# EAGLE schematic v3 (EAGLE 9.6.2)
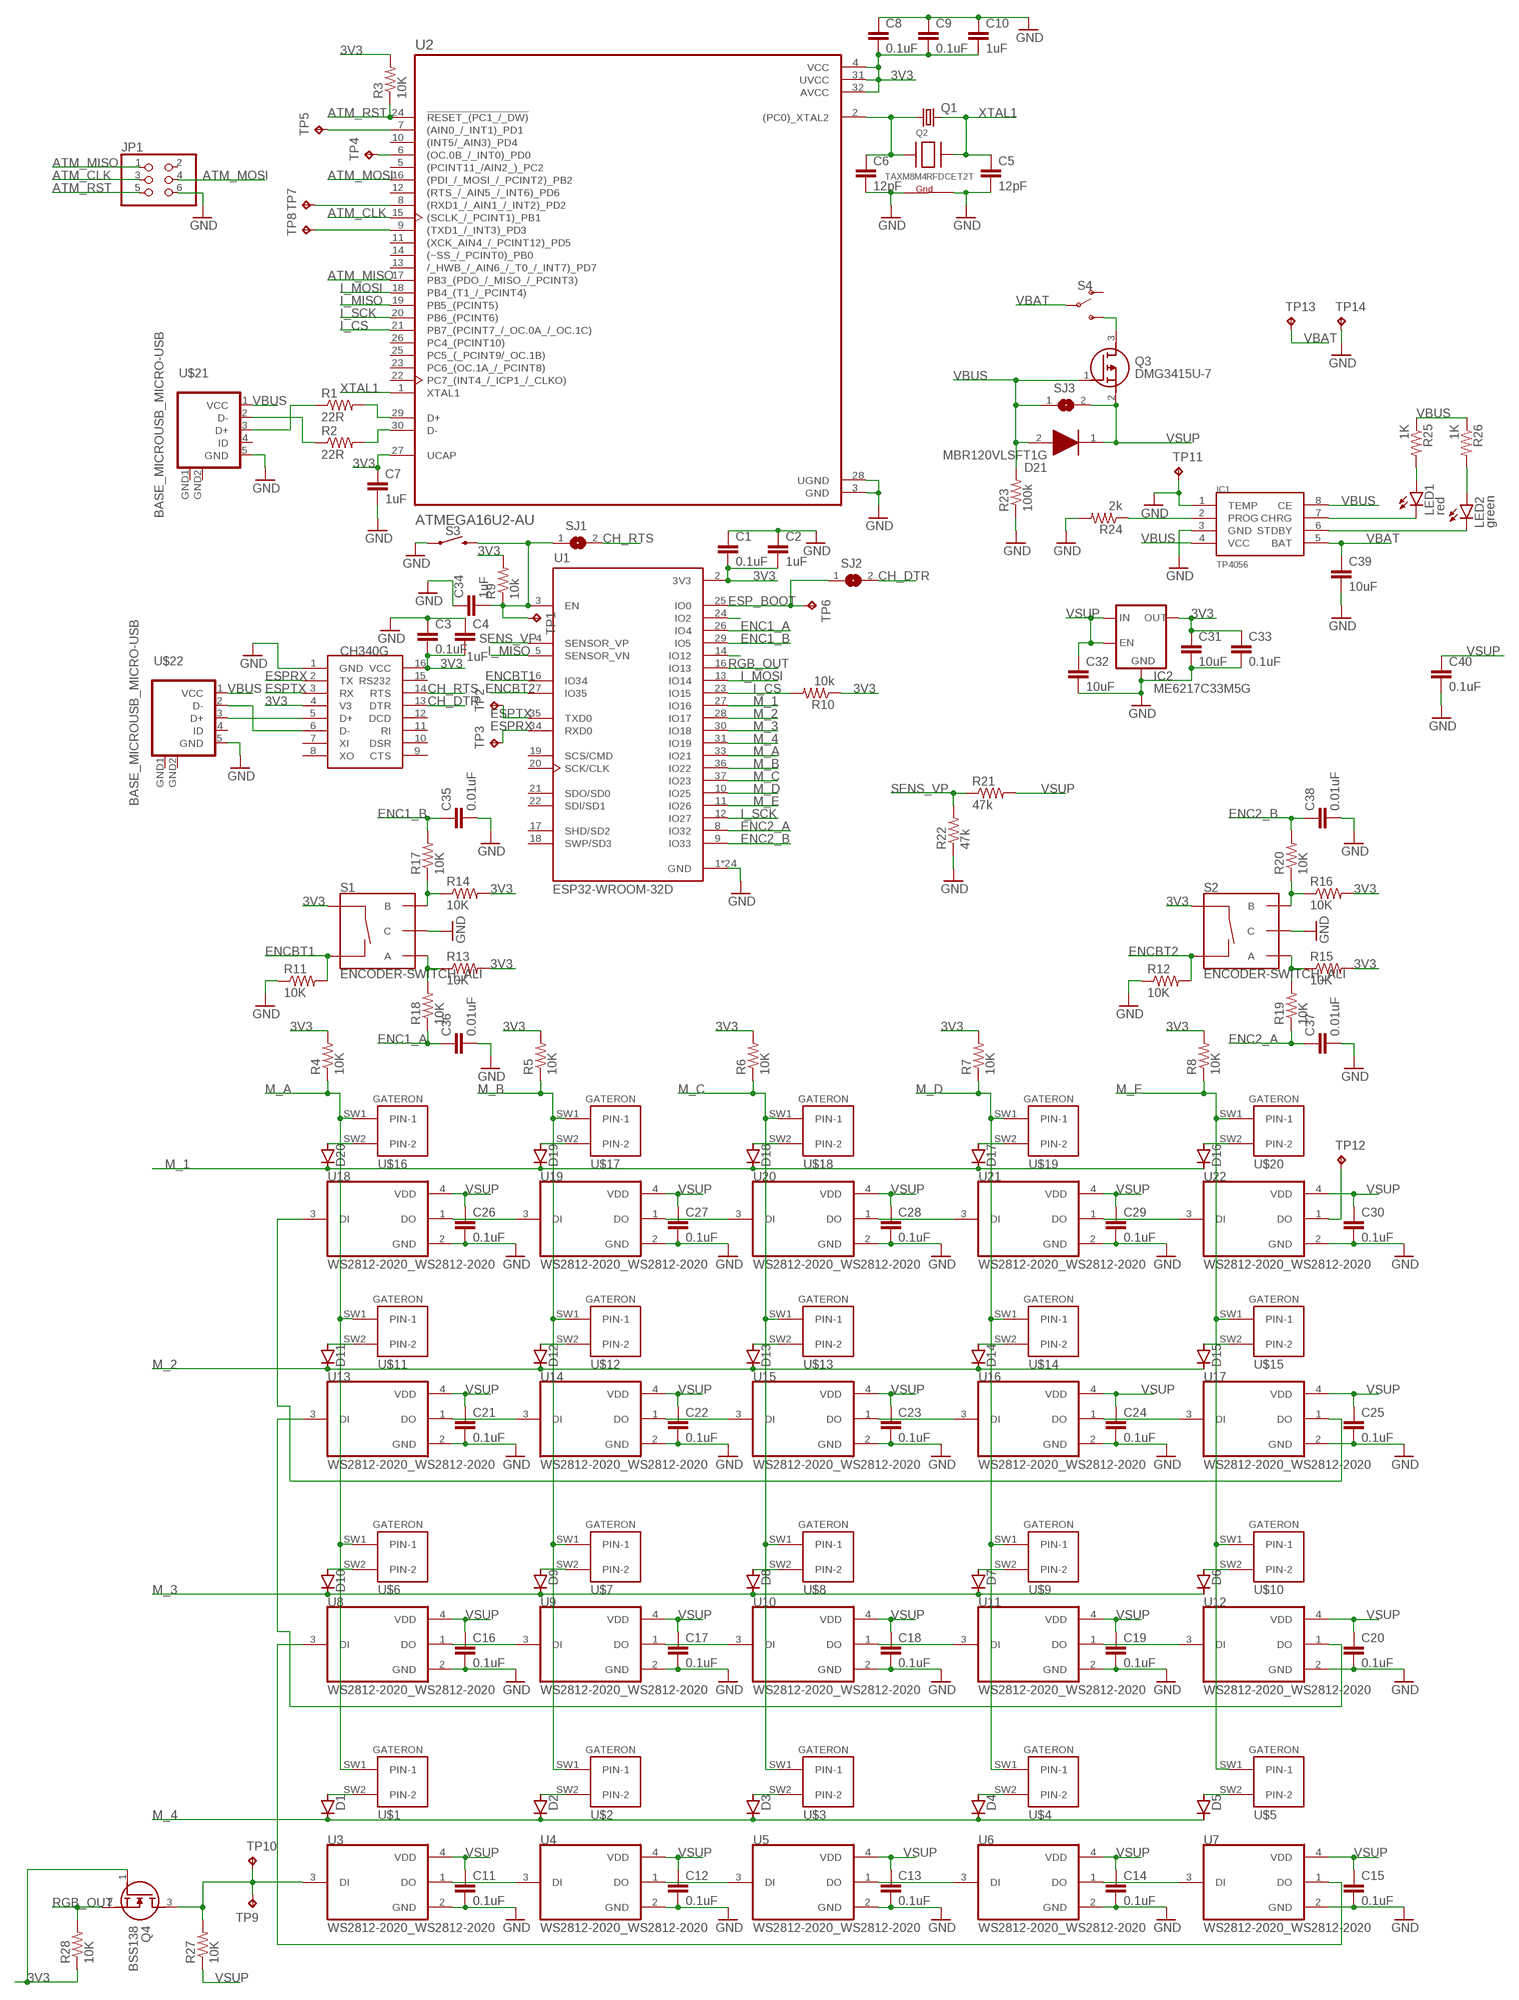
[diagram p0: schematic, sheet 1]

## Parts
C1  0.1uF  C-EUC0805  [C0805]
C2  1uF  C-EUC0805  [C0805]
C3  0.1uF  C-EUC0805  [C0805]
C4  1uF  C-EUC0805  [C0805]
C5  12pF  C-EUC0805  [C0805]
C6  12pF  C-EUC0805  [C0805]
C7  1uF  C-EUC0805  [C0805]
C8  0.1uF  C-EUC0805  [C0805]
C9  0.1uF  C-EUC0805  [C0805]
C10  1uF  C-EUC0805  [C0805]
C11  0.1uF  C-EUC0805  [C0805]
C12  0.1uF  C-EUC0805  [C0805]
C13  0.1uF  C-EUC0805  [C0805]
C14  0.1uF  C-EUC0805  [C0805]
C15  0.1uF  C-EUC0805  [C0805]
C16  0.1uF  C-EUC0805  [C0805]
C17  0.1uF  C-EUC0805  [C0805]
C18  0.1uF  C-EUC0805  [C0805]
C19  0.1uF  C-EUC0805  [C0805]
C20  0.1uF  C-EUC0805  [C0805]
C21  0.1uF  C-EUC0805  [C0805]
C22  0.1uF  C-EUC0805  [C0805]
C23  0.1uF  C-EUC0805  [C0805]
C24  0.1uF  C-EUC0805  [C0805]
C25  0.1uF  C-EUC0805  [C0805]
C26  0.1uF  C-EUC0805  [C0805]
C27  0.1uF  C-EUC0805  [C0805]
C28  0.1uF  C-EUC0805  [C0805]
C29  0.1uF  C-EUC0805  [C0805]
C30  0.1uF  C-EUC0805  [C0805]
C31  10uF  C-EUC0805  [C0805]
C32  10uF  C-EUC0805  [C0805]
C33  0.1uF  C-EUC0805  [C0805]
C34  1uF  C-EUC0805  [C0805]
C35  0.01uF  C-EUC0805  [C0805]
C36  0.01uF  C-EUC0805  [C0805]
C37  0.01uF  C-EUC0805  [C0805]
C38  0.01uF  C-EUC0805  [C0805]
C39  10uF  C-EUC0805  [C0805]
C40  0.1uF  C-EUC0805  [C0805]
D1  D-_2SOD123  [SOD123]
D2  D-_2SOD123  [SOD123]
D3  D-_2SOD123  [SOD123]
D4  D-_2SOD123  [SOD123]
D5  D-_2SOD123  [SOD123]
D6  D-_2SOD123  [SOD123]
D7  D-_2SOD123  [SOD123]
D8  D-_2SOD123  [SOD123]
D9  D-_2SOD123  [SOD123]
D10  D-_2SOD123  [SOD123]
D11  D-_2SOD123  [SOD123]
D12  D-_2SOD123  [SOD123]
D13  D-_2SOD123  [SOD123]
D14  D-_2SOD123  [SOD123]
D15  D-_2SOD123  [SOD123]
D16  D-_2SOD123  [SOD123]
D17  D-_2SOD123  [SOD123]
D18  D-_2SOD123  [SOD123]
D19  D-_2SOD123  [SOD123]
D20  D-_2SOD123  [SOD123]
D21  MBR120VLSFT1G  [SODFL3616X98N]
IC1  TP4056  [SOP-8]
IC2  ME6217C33M5G  TPS70912DBV  [SOT23-5]
JP1  PINHD-2X3  [2X03]
LED1  red  LEDCHIP-LED0805  [CHIP-LED0805]
LED2  green  LEDCHIP-LED0805  [CHIP-LED0805]
Q1  CRYSTALHC49UP  [HC49UP]
Q2  TAXM8M4RFDCET2T  XTAL-4-3225  [NX3225]
Q3  DMG3415U-7  [SOT96P240X120-3N]
Q4  BSS138  [SOT95P240X120-3N]
R1  22R  R-US_R0805  [R0805]
R2  22R  R-US_R0805  [R0805]
R3  10K  R-US_R0805  [R0805]
R4  10K  R-US_R0805  [R0805]
R5  10K  R-US_R0805  [R0805]
R6  10K  R-US_R0805  [R0805]
R7  10K  R-US_R0805  [R0805]
R8  10K  R-US_R0805  [R0805]
R9  10k  R-US_R0805  [R0805]
R10  10k  R-US_R0805  [R0805]
R11  10K  R-US_R0805  [R0805]
R12  10K  R-US_R0805  [R0805]
R13  10K  R-US_R0805  [R0805]
R14  10K  R-US_R0805  [R0805]
R15  10K  R-US_R0805  [R0805]
R16  10K  R-US_R0805  [R0805]
R17  10K  R-US_R0805  [R0805]
R18  10K  R-US_R0805  [R0805]
R19  10K  R-US_R0805  [R0805]
R20  10K  R-US_R0805  [R0805]
R21  47k  R-US_R0805  [R0805]
R22  47k  R-US_R0805  [R0805]
R23  100k  R-US_R0805  [R0805]
R24  2k  R-US_R0805  [R0805]
R25  1K  R-US_R0805  [R0805]
R26  1K  R-US_R0805  [R0805]
R27  10K  R-US_R0805  [R0805]
R28  10K  R-US_R0805  [R0805]
S1  ENCODER-SWITCH_ALI  [ROTARY_ENC_PLAIN_2]
S2  ENCODER-SWITCH_ALI  [ROTARY_ENC_PLAIN_2]
S3  MOMENTARY-SWITCH-SPST-SMD-6.0X3.5MM  [TACTILE_SWITCH_SMD_6.0X3.5MM]
S4  SWITCH-SPDT-SMD-RIGHT-ANGLE  [SWITCH_SPST_SMD_A]
SJ1  SJ  [SJ]
SJ2  SJ  [SJ]
SJ3  SJ  [SJ]
TP1  TPTP19R  [TP19R]
TP2  TPTP19R  [TP19R]
TP3  TPTP19R  [TP19R]
TP4  TPTP19R  [TP19R]
TP5  TPTP19R  [TP19R]
TP6  TPTP19R  [TP19R]
TP7  TPTP19R  [TP19R]
TP8  TPTP19R  [TP19R]
TP9  TPTP19R  [TP19R]
TP10  TPTP19R  [TP19R]
TP11  TPTP19R  [TP19R]
TP12  TPTP19R  [TP19R]
TP13  TPTP19R  [TP19R]
TP14  TPTP19R  [TP19R]
U1  ESP32-WROOM-32D  [MODULE_ESP32-WROOM-32D]
U2  ATMEGA16U2-AU  [QFP80P900X900X120-32N]
U3  WS2812-2020_WS2812-2020  [WS2812-2020_LED_WS2812-2020]
U4  WS2812-2020_WS2812-2020  [WS2812-2020_LED_WS2812-2020]
U5  WS2812-2020_WS2812-2020  [WS2812-2020_LED_WS2812-2020]
U6  WS2812-2020_WS2812-2020  [WS2812-2020_LED_WS2812-2020]
U7  WS2812-2020_WS2812-2020  [WS2812-2020_LED_WS2812-2020]
U8  WS2812-2020_WS2812-2020  [WS2812-2020_LED_WS2812-2020]
U9  WS2812-2020_WS2812-2020  [WS2812-2020_LED_WS2812-2020]
U10  WS2812-2020_WS2812-2020  [WS2812-2020_LED_WS2812-2020]
U11  WS2812-2020_WS2812-2020  [WS2812-2020_LED_WS2812-2020]
U12  WS2812-2020_WS2812-2020  [WS2812-2020_LED_WS2812-2020]
U13  WS2812-2020_WS2812-2020  [WS2812-2020_LED_WS2812-2020]
U14  WS2812-2020_WS2812-2020  [WS2812-2020_LED_WS2812-2020]
U15  WS2812-2020_WS2812-2020  [WS2812-2020_LED_WS2812-2020]
U16  WS2812-2020_WS2812-2020  [WS2812-2020_LED_WS2812-2020]
U17  WS2812-2020_WS2812-2020  [WS2812-2020_LED_WS2812-2020]
U18  WS2812-2020_WS2812-2020  [WS2812-2020_LED_WS2812-2020]
U19  WS2812-2020_WS2812-2020  [WS2812-2020_LED_WS2812-2020]
U20  WS2812-2020_WS2812-2020  [WS2812-2020_LED_WS2812-2020]
U21  WS2812-2020_WS2812-2020  [WS2812-2020_LED_WS2812-2020]
U22  WS2812-2020_WS2812-2020  [WS2812-2020_LED_WS2812-2020]
U$1  GATERON  [GATERON]
U$2  GATERON  [GATERON]
U$3  GATERON  [GATERON]
U$4  GATERON  [GATERON]
U$5  GATERON  [GATERON]
U$6  GATERON  [GATERON]
U$7  GATERON  [GATERON]
U$8  GATERON  [GATERON]
U$9  GATERON  [GATERON]
U$10  GATERON  [GATERON]
U$11  GATERON  [GATERON]
U$12  GATERON  [GATERON]
U$13  GATERON  [GATERON]
U$14  GATERON  [GATERON]
U$15  GATERON  [GATERON]
U$16  GATERON  [GATERON]
U$17  GATERON  [GATERON]
U$18  GATERON  [GATERON]
U$19  GATERON  [GATERON]
U$20  GATERON  [GATERON]
U$21  BASE_MICROUSB_MICRO-USB  [BASE_MICROUSB_MICRO-USB]
U$22  BASE_MICROUSB_MICRO-USB  [BASE_MICROUSB_MICRO-USB]
U$23  CH340G_CH340G  [CH340G_SOIC16]

## Nets
3V3 [pwr]: C1.2 C2.2 C3.2 C4.2 C7.1 C8.2 C9.2 C10.2 C31.1 C33.1 IC2.5(OUT) Q4.1(G) R3.2 R4.2 R5.2 R6.2 R7.2 R8.2 R9.2 R10.1 R13.2 R14.2 R15.2 R16.2 R28.1 S1.SW+ S2.SW+ U1.2(3V3) U2.4(VCC) U2.27(UCAP) U2.31(UVCC) U2.32(AVCC) U$23.4(V3) U$23.16(VCC)
ATM_CLK: JP1.3 U2.15((SCLK_/_PCINT1)_PB1)
ATM_MISO: JP1.1 U2.17(PB3_(PDO_/_MISO_/_PCINT3))
ATM_MOSI: JP1.4 U2.16((PDI_/_MOSI_/_PCINT2)_PB2)
ATM_RST: JP1.5 R3.1 U2.24(!RESET_(PC1_/_DW))
CH_DTR: SJ2.2 U$23.13(DTR)
CH_RTS: SJ1.2 U$23.14(RTS)
ENC1_A: C36.1 R18.1 U1.26(IO4)
ENC1_B: C35.1 R17.2 U1.29(IO5)
ENC2_A: C37.1 R19.1 U1.8(IO32)
ENC2_B: C38.1 R20.2 U1.9(IO33)
ENCBT1: R11.2 S1.SW- U1.6(IO34)
ENCBT2: R12.2 S2.SW- U1.7(IO35)
ESP_BOOT: SJ2.1 TP6.TP U1.25(IO0)
ESPRX: TP3.TP U1.34(RXD0) U$23.2(TX)
ESPTX: TP2.TP U1.35(TXD0) U$23.3(RX)
GND [pwr]: C1.1 C2.1 C3.1 C4.1 C5.2 C6.2 C7.2 C8.1 C9.1 C10.1 C11.2 C12.2 C13.2 C14.2 C15.2 C16.2 C17.2 C18.2 C19.2 C20.2 C21.2 C22.2 C23.2 C24.2 C25.2 C26.2 C27.2 C28.2 C29.2 C30.2 C31.2 C32.2 C33.2 C34.1 C35.2 C36.2 C37.2 C38.2 C39.2 C40.2 IC1.1(TEMP) IC1.3(GND) IC2.2(GND) JP1.6 Q2.2(G2) Q2.4(G1) R11.1 R12.1 R22.1 R23.1 R24.2 S1.C S2.C S3.1 TP11.TP TP14.TP U1.1(GND) U1.15(GND) U1.38(GND) U1.39_1(GND) U1.39_2(GND) U1.39_3(GND) U1.39_4(GND) U1.39_5(GND) U1.39_6(GND) U1.39_7(GND) U1.39_8(GND) U1.39_9(GND) U1.39_10(GND) U1.39_11(GND) U1.39_12(GND) U1.39_13(GND) U1.39_14(GND) U1.39_15(GND) U1.39_16(GND) U1.39_17(GND) U1.39_18(GND) U1.39_19(GND) U1.39_20(GND) U1.39_21(GND) U2.3(GND) U2.28(UGND) U3.2(GND) U4.2(GND) U5.2(GND) U6.2(GND) U7.2(GND) U8.2(GND) U9.2(GND) U10.2(GND) U11.2(GND) U12.2(GND) U13.2(GND) U14.2(GND) U15.2(GND) U16.2(GND) U17.2(GND) U18.2(GND) U19.2(GND) U20.2(GND) U21.2(GND) U22.2(GND) U$21.5(GND) U$22.5(GND) U$23.1(GND)
I_CS: R10.2 U1.23(IO15) U2.21(PB7_(PCINT7_/_OC.0A_/_OC.1C))
I_MISO: U1.5(SENSOR_VN) U2.19(PB5_(PCINT5))
I_MOSI: U1.13(IO14) U2.18(PB4_(T1_/_PCINT4))
I_SCK: U1.12(IO27) U2.20(PB6_(PCINT6))
M_1: D16.1(C) D17.1(C) D18.1(C) D19.1(C) D20.1(C) U1.27(IO16)
M_2: D11.1(C) D12.1(C) D13.1(C) D14.1(C) D15.1(C) U1.28(IO17)
M_3: D6.1(C) D7.1(C) D8.1(C) D9.1(C) D10.1(C) U1.30(IO18)
M_4: D1.1(C) D2.1(C) D3.1(C) D4.1(C) D5.1(C) U1.31(IO19)
M_A: R4.1 U1.33(IO21) U$1.SW1(PIN-1) U$6.SW1(PIN-1) U$11.SW1(PIN-1) U$16.SW1(PIN-1)
M_B: R5.1 U1.36(IO22) U$2.SW1(PIN-1) U$7.SW1(PIN-1) U$12.SW1(PIN-1) U$17.SW1(PIN-1)
M_C: R6.1 U1.37(IO23) U$3.SW1(PIN-1) U$8.SW1(PIN-1) U$13.SW1(PIN-1) U$18.SW1(PIN-1)
M_D: R7.1 U1.10(IO25) U$4.SW1(PIN-1) U$9.SW1(PIN-1) U$14.SW1(PIN-1) U$19.SW1(PIN-1)
M_E: R8.1 U1.11(IO26) U$5.SW1(PIN-1) U$10.SW1(PIN-1) U$15.SW1(PIN-1) U$20.SW1(PIN-1)
N$1: R1.1 U$21.3(D+)
N$2: R1.2 U2.29(D+)
N$3: R2.2 U2.30(D-)
N$4: U$22.2(D-) U$23.6(D-)
N$5: R2.1 U$21.2(D-)
N$6: U$22.3(D+) U$23.5(D+)
N$7: C6.1 Q1.1 Q2.1(X1) U2.2((PC0)_XTAL2)
N$8: U3.1(DO) U4.3(DI)
N$9: U4.1(DO) U5.3(DI)
N$10: U5.1(DO) U6.3(DI)
N$11: U6.1(DO) U7.3(DI)
N$12: U7.1(DO) U8.3(DI)
N$13: U8.1(DO) U9.3(DI)
N$14: U9.1(DO) U10.3(DI)
N$15: U10.1(DO) U11.3(DI)
N$16: U11.1(DO) U12.3(DI)
N$17: U12.1(DO) U13.3(DI)
N$18: U13.1(DO) U14.3(DI)
N$19: U14.1(DO) U15.3(DI)
N$20: U15.1(DO) U16.3(DI)
N$21: U16.1(DO) U17.3(DI)
N$22: U17.1(DO) U18.3(DI)
N$23: U18.1(DO) U19.3(DI)
N$24: U19.1(DO) U20.3(DI)
N$25: U20.1(DO) U21.3(DI)
N$26: U21.1(DO) U22.3(DI)
N$27: Q4.3(D) R27.2 TP9.TP TP10.TP U3.3(DI)
N$28: IC1.2(PROG) R24.1
N$29: IC1.7(CHRG) LED1.C
N$30: LED1.A R25.2
N$31: IC1.6(STDBY) LED2.C
N$32: LED2.A R26.2
N$33: TP12.TP U22.1(DO)
N$34: Q3.3(D) S4.3(S)
N$35: R16.1 R20.1 S2.B
N$36: R15.1 R19.2 S2.A
N$37: R14.1 R17.1 S1.B
N$38: R13.1 R18.2 S1.A
N$68: D1.2(A) U$1.SW2(PIN-2)
N$69: D2.2(A) U$2.SW2(PIN-2)
N$70: D3.2(A) U$3.SW2(PIN-2)
N$71: D4.2(A) U$4.SW2(PIN-2)
N$72: D5.2(A) U$5.SW2(PIN-2)
N$73: D6.2(A) U$10.SW2(PIN-2)
N$74: D15.2(A) U$15.SW2(PIN-2)
N$75: D7.2(A) U$9.SW2(PIN-2)
N$76: D8.2(A) U$8.SW2(PIN-2)
N$77: D13.2(A) U$13.SW2(PIN-2)
N$78: D14.2(A) U$14.SW2(PIN-2)
N$79: D9.2(A) U$7.SW2(PIN-2)
N$80: D10.2(A) U$6.SW2(PIN-2)
N$81: D11.2(A) U$11.SW2(PIN-2)
N$82: D12.2(A) U$12.SW2(PIN-2)
N$83: D20.2(A) U$16.SW2(PIN-2)
N$84: D19.2(A) U$17.SW2(PIN-2)
N$85: D18.2(A) U$18.SW2(PIN-2)
N$86: D17.2(A) U$19.SW2(PIN-2)
N$87: D16.2(A) U$20.SW2(PIN-2)
N$88: C34.2 R9.1 S3.2 SJ1.1 TP1.TP U1.3(EN)
N$90: TP4.TP U2.6((OC.0B_/_INT0)_PD0)
N$91: TP5.TP U2.7((AIN0_/_INT1)_PD1)
N$92: U1.24(IO2)
N$94: U1.14(IO12)
N$100: TP8.TP U2.9((TXD1_/_INT3)_PD3)
N$101: TP7.TP U2.8((RXD1_/_AIN1_/_INT2)_PD2)
RGB_OUT: Q4.2(S) R28.2 U1.16(IO13)
SENS_VP: R21.1 R22.2 U1.4(SENSOR_VP)
VBAT [pwr]: C39.1 IC1.5(BAT) S4.2(P) TP13.TP
VBUS [pwr]: D21.2(A) IC1.4(VCC) IC1.8(CE) Q3.1(G) R23.2 R25.1 R26.1 SJ3.1 U$21.1(VCC) U$22.1(VCC)
VSUP [pwr]: C11.1 C12.1 C13.1 C14.1 C15.1 C16.1 C17.1 C18.1 C19.1 C20.1 C21.1 C22.1 C23.1 C24.1 C25.1 C26.1 C27.1 C28.1 C29.1 C30.1 C32.1 C40.1 D21.1(K) IC2.1(IN) IC2.3(EN) Q3.2(S) R21.2 R27.1 SJ3.2 U3.4(VDD) U4.4(VDD) U5.4(VDD) U6.4(VDD) U7.4(VDD) U8.4(VDD) U9.4(VDD) U10.4(VDD) U11.4(VDD) U12.4(VDD) U13.4(VDD) U14.4(VDD) U15.4(VDD) U16.4(VDD) U17.4(VDD) U18.4(VDD) U19.4(VDD) U20.4(VDD) U21.4(VDD) U22.4(VDD)
XTAL1: C5.1 Q1.2 Q2.3(X2) U2.1(XTAL1)
Unconnected: JP1.2 S4.1(O) U1.17(SHD/SD2) U1.18(SWP/SD3) U1.19(SCS/CMD) U1.20(SCK/CLK) U1.21(SDO/SD0) U1.22(SDI/SD1) U2.5((PCINT11_/AIN2_)_PC2) U2.10((INT5/_AIN3)_PD4) U2.11((XCK_AIN4_/_PCINT12)_PD5) U2.12((RTS_/_AIN5_/_INT6)_PD6) U2.13(/_HWB_/_AIN6_/_T0_/_INT7)_PD7) U2.14((~SS_/_PCINT0)_PB0) U2.22(PC7_(INT4_/_ICP1_/_CLKO)) U2.23(PC6_(OC.1A_/_PCINT8)) U2.25(PC5_(_PCINT9/_OC.1B)) U2.26(PC4_(PCINT10)) U$21.4(ID) U$22.4(ID) U$23.7(XI) U$23.8(XO) U$23.9(CTS) U$23.10(DSR) U$23.11(RI) U$23.12(DCD) U$23.15(RS232)

## Power pins joined to a net without a drawn wire
GND: U$21.GND1(GND) U$21.GND2(GND) U$22.GND1(GND) U$22.GND2(GND)

## Library data of the parts
C1-C40 = rcl:C-EU: CAPACITOR, European symbol; SPICEPREFIX: C
D1-D20 = semicon-smd-ipc:D-_2: DIODE unfilled
D21 = MBR120VLSFT1G:MBR120VLSFT1G: Diode Schottky 20V 1A SOD123FL ON Semi MBR120VLSFT1G, SMT Schottky Diode, 20V 1A, 2-Pin SOD-123FL Source: Datasheet <http://www.onsemi.com/pub/Collateral/MBR120VLSFT1-D.PDF>; ARROW_PART_NUMBER: MBR120VLSFT1G; ARROW_PRICE-STOCK: https://www.arrow.com/en/products/mbr120vlsft1g/on-semiconductor; DESCRIPTION: Diode Schottky 20V 1A SOD123FL ON Semi MBR120VLSFT1G, SMT Schottky Diode, 20V 1A, 2-Pin SOD-123FL; HEIGHT: 0.98mm; MANUFACTURER_NAME: ON Semiconductor; MANUFACTURER_PART_NUMBER: MBR120VLSFT1G; MOUSER_PART_NUMBER: 863-MBR120VLSFT1G; MOUSER_PRICE-STOCK: https://www.mouser.co.uk/ProductDetail/ON-Semiconductor/MBR120VLSFT1G?qs=3JMERSakebpX%252BkItPpFCkg%3D%3D
IC1 = TP4056:TP4056
IC2 = tps709xx_10:TPS709*: TPS709xx 150-mA, 30-V, 1-μA IQ Voltage Regulators with Enable Source: http://www.ti.com/lit/ds/symlink/tps709.pdf; MF: Texas Instruments; MPN: TPS70912DBVT; OC_FARNELL: unknown; OC_NEWARK: unknown
JP1 = pinhead:PINHD-2X3: PIN HEADER
LED1 LED2 = led:LED: LED OSRAM: - CHIPLED LG R971, LG N971, LY N971, LG Q971, LY Q971, LO R971, LY R971 LH N974, LH R974 LS Q976, LO Q976, LY Q976 LO Q996 - Hyper CHIPLED LW Q18S LB Q993, LB Q99A, LB R99A - SideLED LS A670, LO A670, LY A670, LG A670, LP A670 LB A673, LV A673, LT A673, LW A673 LH A674 LY A675 LS A676, LA A676, LO A676, LY A676, LW A676 LS A679, LY A679, LG A679 - Hyper Micro SIDELED® LS Y876, LA Y876, LO Y876, LY Y876 LT Y87S - SmartLED LW L88C, LW L88S LB L89C, LB L89S, LG L890 LS L89K, LO L89K, LY L89K LS L896, LA L896, LO L896, LY L896 - TOPLED LS T670, LO T670, LY T670, LG T670, LP T670 LSG T670, LSP T670, LSY T670, LOP T670, LYG T670 LG T671, LOG T671, LSG T671 LB T673, LV T673, LT T673, LW T673 LH T674 LS T676, LA T676, LO T676, LY T676, LB T676, LH T676, LSB T676, LW T676 LB T67C, LV T67C, LT T67C, LS T67K, LO T67K, LY T67K, LW E67C LS E67B, LA E67B, LO E67B, LY E67B, LB E67C, LV E67C, LT E67C LW T67C LS T679, LY T679, LG T679 LS T770, LO T770, LY T770, LG T770, LP T770 LB T773, LV T773, LT T773, LW T773 LH T774 LS E675, LA E675, LY E675, LS T675 LS T776, LA T776, LO T776, LY T776, LB T776 LHGB T686 LT T68C, LB T68C - Hyper Mini TOPLED® LB M676 - Mini TOPLED Santana® LG M470 LS M47K, LO M47K, LY M47K Source: http://www.osram.convergy.de LUXEON: - LUMILED® LXK2-PW12-R00, LXK2-PW12-S00, LXK2-PW14-U00, LXK2-PW14-V00 LXK2-PM12-R00, LXK2-PM12-S00, LXK2-PM14-U00 LXK2-PE12-Q00, LXK2-PE12-R00, LXK2-PE12-S00, LXK2-PE14-T00, LXK2-PE14-U00 LXK2-PB12-K00, LXK2-PB12-L00, LXK2-PB12-M00, LXK2-PB14-N00, LXK2-PB14-P00, LXK2-PB14-Q00 LXK2-PR12-L00, LXK2-PR12-M00, LXK2-PR14-Q00, LXK2-PR14-R00 LXK2-PD12-Q00, LXK2-PD12-R00, LXK2-PD12-S00 LXK2-PH12-R00, LXK2-PH12-S00 LXK2-PL12-P00, LXK2-PL12-Q00, LXK2-PL12-R00 Source: www.luxeon.com KINGBRIGHT: KA-3528ASYC Source: www.kingbright.com
Q1 = crystal:CRYSTAL: CRYSTAL; OC_FARNELL: unknown; OC_NEWARK: unknown
Q2 = adafruit:XTAL-4: Classic 4-pin 3.2 x 2.5mm crystal
Q3 = DMG3415U-7:DMG3415U-7: P-CHANNEL ENHANCEMENT MODE MOSFET Source: Datasheet <http://docs-emea.rs-online.com/webdocs/104e/0900766b8104e4f0.pdf>; ARROW_PART_NUMBER: DMG3415U-7; ARROW_PRICE-STOCK: https://www.arrow.com/en/products/dmg3415u-7/diodes-incorporated; DESCRIPTION: P-CHANNEL ENHANCEMENT MODE MOSFET; HEIGHT: 1.2mm; MANUFACTURER_NAME: Diodes Inc.; MANUFACTURER_PART_NUMBER: DMG3415U-7; MOUSER_PART_NUMBER: 621-DMG3415U-7; MOUSER_PRICE-STOCK: https://www.mouser.co.uk/ProductDetail/Diodes-Incorporated/DMG3415U-7?qs=oUsD4qhOtFwqFLkI6WCRAA%3D%3D
Q4 = BSS138:BSS138: N-channel MOSFET,BSS138 0.2A 50V Source: Datasheet <https://www.onsemi.com/pub/Collateral/BSS138-D.PDF>; ARROW_PART_NUMBER: BSS138; ARROW_PRICE-STOCK: https://www.arrow.com/en/products/bss138/on-semiconductor; DESCRIPTION: N-channel MOSFET,BSS138 0.2A 50V; HEIGHT: 1.2mm; MANUFACTURER_NAME: ON Semiconductor; MANUFACTURER_PART_NUMBER: BSS138; MOUSER_PART_NUMBER: 512-BSS138; MOUSER_PRICE-STOCK: https://www.mouser.co.uk/ProductDetail/ON-Semiconductor-Fairchild/BSS138?qs=HK%252BeIG1iaahCeqBvjB4arg%3D%3D
R1-R28 = rcl:R-US_: RESISTOR, American symbol; SPICEPREFIX: R
S1 S2 = SparkFun-Switches2:ENCODER-SWITCH_ALI: Rotary Encoder w/ Select Switch Encoders rotate similarly to potentiometers, but they’re different from potentiometers in that an encoder has full rotation without limits. They output gray code so that you can tell how much and in which direction the encoder has been turned. This encoder includes a push-down select switch built into the shaft. SparkFun Products Rotary Encoder <https://www.sparkfun.com/products/9117> (COM-09117); SF_SKU: COM-09117
S3 = SparkFun-Switches:MOMENTARY-SWITCH-SPST: Momentary Switch (Pushbutton) - SPST Normally-open (NO) SPST momentary switches (buttons, pushbuttons). Variants PTH-12MM - 12mm square, through-hole Momentary Pushbutton Switch - 12mm Square <https://www.sparkfun.com/products/9190> (COM-09190) PTH-6.0MM, PTH-6.0MM-KIT - 6.0mm square, through-hole Mini Pushbutton Switch <https://www.sparkfun.com/products/97> (COM-00097) KIT package intended for soldering kit's - only one side of pads' copper is exposed. PTH-RIGHT-ANGLE-KIT - Right-angle, through-hole Right Angle Tactile Button <https://www.sparkfun.com/products/10791> - Used on SparkFun BigTime Watch Kit <https://www.sparkfun.com/products/11734> SMD-12MM - 12mm square, surface-mount Tactile Button - SMD (12mm) <https://www.sparkfun.com/products/12993> (COM-12993) Used on SparkFun PicoBoard <https://www.sparkfun.com/products/11888> SMD-4.5MM - 4.5mm Square Trackball Switch Used on SparkFun Blackberry Trackballer Breakout <https://www.sparkfun.com/products/13169> SMD-4.6MMX2.8MM - 4.60mm x 2.80mm, surface mount Used on SparkFun SAMD21 Mini Breakout <https://www.sparkfun.com/products/13664> SMD-5.2MM, SMD-5.2-REDUNDANT - 5.2mm square, surface-mount Mini Pushbutton Switch - SMD <https://www.sparkfun.com/products/8720> (COM-08720) Used on Arduino Pro Mini <https://www.sparkfun.com/products/11114> REDUNDANT package connects both switch circuits together SMD-6.0X3.5MM - 6.0 x 3.5mm, surface mount Momentary Reset Switch SMD <https://www.sparkfun.com/products/8229> (COM-08229) SMD-6.2MM-TALL - 6.2mm square, surface mount Tactile Button - SMD (6mm) <https://www.sparkfun.com/products/12992> Used on SparkFun Digital Sandbox <https://www.sparkfun.com/products/12651> SMD-RIGHT-ANGLE - Right-angle, surface mount Used on SparkFun Block for Intel® Edison - Arduino <https://www.sparkfun.com/products/13036>; PROD_ID: SWCH-00815; SF_SKU: COM-08229
S4 = SparkFun-Switches:SWITCH-SPDT: Single Pole, Double Throw (SPDT) Switch Single-pole, double-throw (SPDT) switch. Variant Overview SMD-AYZ0202 Surface Mount DPDT Switch <https://www.sparkfun.com/products/597> (COM-00597) Used on e.g. LilyPad Arduino USB - ATmega32U4 Board <https://www.sparkfun.com/products/12049> PTH-11.6X4.0MM SPDT Mini Power Switch <https://www.sparkfun.com/products/102> (COM-00102) Used on e.g. SparkFun Simon Says - Through-Hole Soldering Kit <https://www.sparkfun.com/products/10547> (KIT-10547) PTH-11.6X4.0MM-KIT KIT version of SPDT Mini Power Switch - Simplifies soldering by removing tStop of switch pins - only one side can be soldered. PTH-11.6X4.0MM-LOCK LOCK version of SPDT Mini Power Switch - Offset pins hold switch in place for easier soldering. SMD-RIGHT-ANGLE Surface Mount Right Angle Switch <https://www.sparkfun.com/products/10860> (COM-10860) Used on e.g. SparkFun ESP8266 Thing <https://www.sparkfun.com/products/13231>; PROD_ID: SWCH-10651; SF_SKU: COM-10860
SJ1-SJ3 = jumper:SJ: SMD solder JUMPER
TP1-TP14 = testpad:TP: Test pad
U1 = ESP32-WROOM-32D:ESP32-WROOM-32D: Bluetooth, WiFi 802.11b/g/n, Bluetooth v4.2 + EDR, Class 1, 2 and 3 Transceiver Module 2.4GHz ~ 2.5GHz Integrated, Trace Surface Mount Check prices <https://pricing.snapeda.com/parts/ESP32-WROOM-32D/Espressif%20Systems/view-part?ref=eda>; AVAILABILITY: Not in stock; DESCRIPTION: Bluetooth, WiFi 802.11b/g/n, Bluetooth v4.2 +EDR, Class 1, 2 and 3 Transceiver Module 2.4GHz ~ 2.5GHz Integrated; MF: Espressif Systems; MP: ESP32-WROOM-32D; PACKAGE: Module Espressif Systems; PRICE: None
U2 = ATMEGA16U2-AU:ATMEGA16U2-AU: Check prices <https://pricing.snapeda.com/parts/ATMEGA16U2-AU/Microchip/view-part?ref=eda>; AVAILABILITY: No availability data; DESCRIPTION: AVR AVR® ATmega Microcontroller IC 8-Bit 16MHz 16KB (8K x 16) FLASH 32-TQFP (7x7); MF: Microchip; MP: ATMEGA16U2-AU; PACKAGE: TQFP-32 Microchip; PRICE: None
U3-U22 = design:WS2812-2020_WS2812-2020: Intelligent control LED integrated light source; AVAILABILITY: Unavailable; MF: Worldsemi; MP: WS2812-2020; PACKAGE: Package; PRICE: None
U$1-U$20 = gateron:GATERON: Gateron keyswitch
U$21 U$22 = design:BASE_MICROUSB_MICRO-USB: Micro USB B connector
U$23 = design:CH340G_CH340G

## Net classes
1 pwr: width 0.279 mm